# EAGLE design adclk (EAGLE 6.5.0)
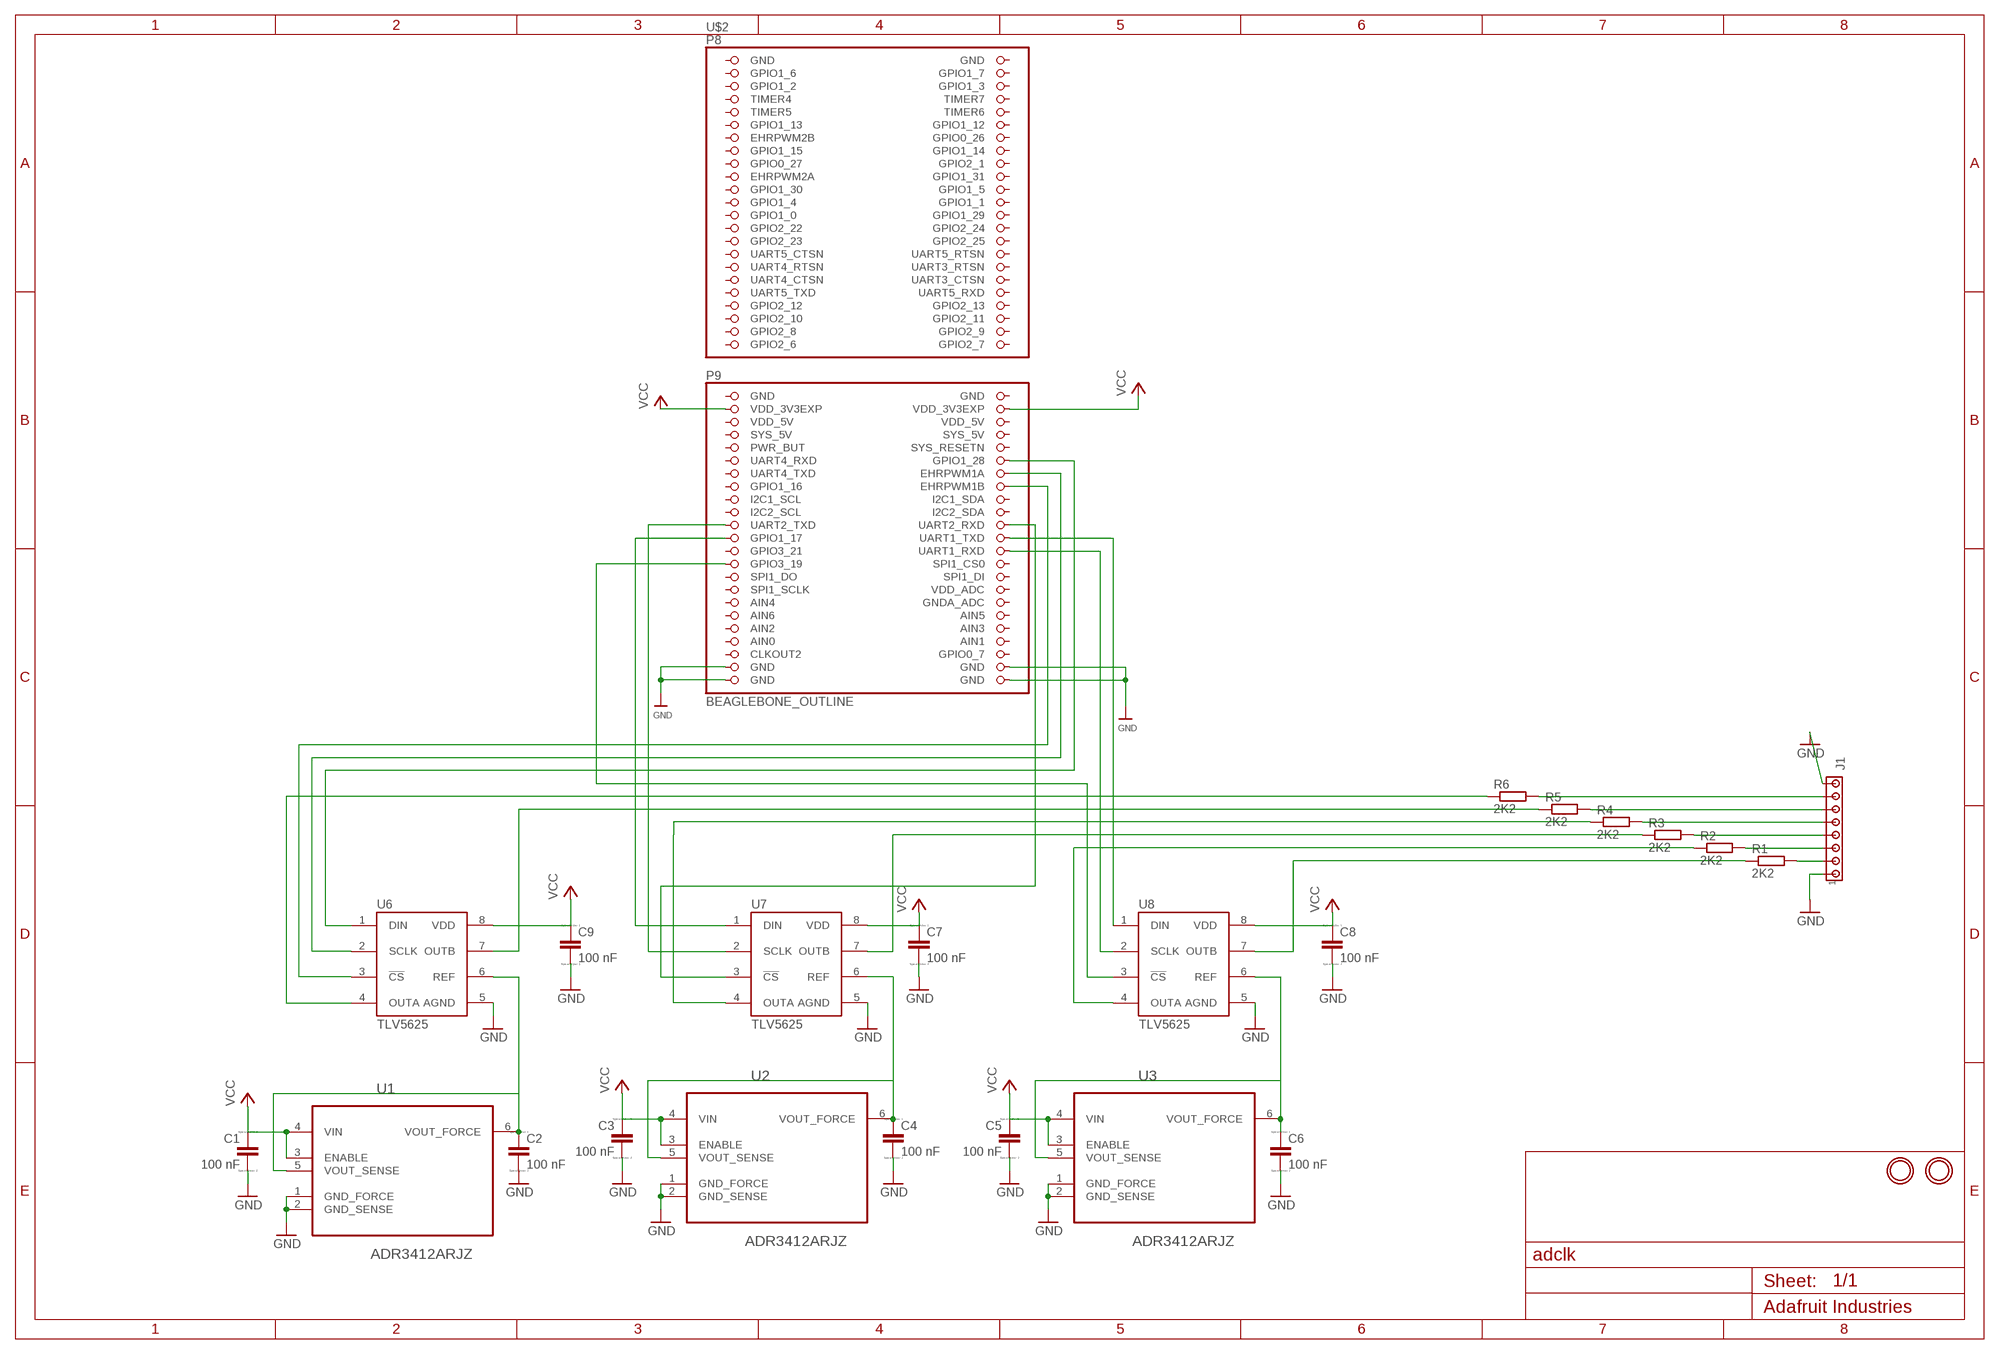
[diagram p0: schematic, sheet 1]

## Parts
C1  100 nF  CC1808  [C1808]
C2  100 nF  CC1808  [C1808]
C3  100 nF  CC1808  [C1808]
C4  100 nF  CC1808  [C1808]
C5  100 nF  CC1808  [C1808]
C6  100 nF  CC1808  [C1808]
C7  100 nF  CC1808  [C1808]
C8  100 nF  CC1808  [C1808]
C9  100 nF  CC1808  [C1808]
J1  MTA08-100  [10X08MTA]
R1  2K2  R-EU_R0805  [R0805]
R2  2K2  R-EU_R0805  [R0805]
R3  2K2  R-EU_R0805  [R0805]
R4  2K2  R-EU_R0805  [R0805]
R5  2K2  R-EU_R0805  [R0805]
R6  2K2  R-EU_R0805  [R0805]
U1  ADR3412ARJZ  [SOT95P280X145-6N]
U2  ADR3412ARJZ  [SOT95P280X145-6N]
U3  ADR3412ARJZ  [SOT95P280X145-6N]
U6  TLV5625  [SO8]
U7  TLV5625  [SO8]
U8  TLV5625  [SO8]
U$2  BEAGLEBONE_OUTLINE  [BEAGLEBONE_SHIELD]
U$22  MOUNTINGHOLE3.0THIN  [MOUNTINGHOLE_3.0_PLATEDTHIN]
U$23  MOUNTINGHOLE3.0THIN  [MOUNTINGHOLE_3.0_PLATEDTHIN]

## Nets
GND: C1.2 C2.2 C3.2 C4.2 C5.2 C6.2 C7.2 C8.2 C9.2 J1.1 J1.8 U1.1(GND_FORCE) U1.2(GND_SENSE) U2.1(GND_FORCE) U2.2(GND_SENSE) U3.1(GND_FORCE) U3.2(GND_SENSE) U6.5(AGND) U7.5(AGND) U8.5(AGND) U$2.89(GND) U$2.90(GND) U$2.91(GND) U$2.92(GND)
N$1: J1.7 R6.2
N$2: J1.6 R5.2
N$3: J1.5 R4.2
N$4: J1.4 R3.2
N$5: J1.3 R2.2
N$6: J1.2 R1.2
N$13: C2.1 U1.5(VOUT_SENSE) U1.6(VOUT_FORCE) U6.6(REF)
N$14: R1.1 U8.7(OUTB)
N$15: C4.1 U2.5(VOUT_SENSE) U2.6(VOUT_FORCE) U7.6(REF)
N$16: R2.1 U8.4(OUTA)
N$17: C6.1 U3.5(VOUT_SENSE) U3.6(VOUT_FORCE) U8.6(REF)
N$18: R3.1 U7.7(OUTB)
N$19: R4.1 U7.4(OUTA)
N$20: R5.1 U6.7(OUTB)
N$21: R6.1 U6.4(OUTA)
N$22: U6.1(DIN) U$2.58(GPIO1_28)
N$23: U6.2(SCLK) U$2.60(EHRPWM1A)
N$24: U6.3(!CS!) U$2.62(EHRPWM1B)
N$25: U8.1(DIN) U$2.70(UART1_TXD)
N$26: U8.2(SCLK) U$2.72(UART1_RXD)
N$27: U8.3(!CS!) U$2.73(GPIO3_19)
N$28: U7.1(DIN) U$2.69(GPIO1_17)
N$29: U7.3(!CS!) U$2.68(UART2_RXD)
N$30: U7.2(SCLK) U$2.67(UART2_TXD)
VCC: C1.1 C3.1 C5.1 C7.1 C8.1 C9.1 U1.3(ENABLE) U1.4(VIN) U2.3(ENABLE) U2.4(VIN) U3.3(ENABLE) U3.4(VIN) U6.8(VDD) U7.8(VDD) U8.8(VDD) U$2.49(VDD_3V3EXP) U$2.50(VDD_3V3EXP)
Unconnected: U$2.5(GPIO1_2) U$2.6(GPIO1_3) U$2.7(TIMER4) U$2.8(TIMER7) U$2.9(TIMER5) U$2.10(TIMER6) U$2.11(GPIO1_13) U$2.12(GPIO1_12) U$2.13(EHRPWM2B) U$2.14(GPIO0_26) U$2.15(GPIO1_15) U$2.16(GPIO1_14) U$2.17(GPIO0_27) U$2.18(GPIO2_1) U$2.19(EHRPWM2A) U$2.20(GPIO1_31) U$2.21(GPIO1_30) U$2.22(GPIO1_5) U$2.23(GPIO1_4) U$2.24(GPIO1_1) U$2.25(GPIO1_0) U$2.26(GPIO1_29) U$2.27(GPIO2_22) U$2.28(GPIO2_24) U$2.29(GPIO2_23) U$2.30(GPIO2_25) U$2.31(UART5_CTSN) U$2.32(UART5_RTSN) U$2.33(UART4_RTSN) U$2.34(UART3_RTSN) U$2.35(UART4_CTSN) U$2.36(UART3_CTSN) U$2.37(UART5_TXD) U$2.38(UART5_RXD) U$2.39(GPIO2_12) U$2.40(GPIO2_13) U$2.41(GPIO2_10) U$2.53(SYS_5V) U$2.54(SYS_5V) U$2.55(PWR_BUT) U$2.56(SYS_RESETN) U$2.57(UART4_RXD) U$2.59(UART4_TXD) U$2.61(GPIO1_16) U$2.63(I2C1_SCL) U$2.64(I2C1_SDA) U$2.65(I2C2_SCL) U$2.66(I2C2_SDA) U$2.71(GPIO3_21) U$2.74(SPI1_CS0) U$2.75(SPI1_DO) U$2.76(SPI1_DI) U$2.77(SPI1_SCLK) U$2.78(VDD_ADC) U$2.79(AIN4) U$2.80(GNDA_ADC) U$2.81(AIN6) U$2.82(AIN5) U$2.83(AIN2) U$2.86(AIN1) U$2.87(CLKOUT2) U$2.88(GPIO0_7)

## Power pins joined to a net without a drawn wire
AIN0: U$2.85(AIN0)
AIN3: U$2.84(AIN3)
GND: U$2.1(GND) U$2.2(GND) U$2.47(GND) U$2.48(GND)
GPIO1_6: U$2.3(GPIO1_6)
GPIO1_7: U$2.4(GPIO1_7)
GPIO2_6: U$2.45(GPIO2_6)
GPIO2_7: U$2.46(GPIO2_7)
GPIO2_8: U$2.43(GPIO2_8)
GPIO2_9: U$2.44(GPIO2_9)
GPIO2_11: U$2.42(GPIO2_11)
VDD_5V: U$2.51(VDD_5V) U$2.52(VDD_5V)

## Library data of the parts
C1-C9 = eagle-ltspice:C: CAPACITOR, European symbol; SPICEMODEL: NONE; SPICEPREFIX: C
J1 = con-amp:MTA08-100: AMP connector
R1-R6 = resistor:R-EU_: RESISTOR, European symbol
U1-U3 = mjw:ADR3412ARJZ: Micropower, High Accuracy Voltage References; MPN: ADR3412ARJZ; OC_FARNELL: 1843661; OC_NEWARK: 12T1265; PACKAGE: SOT-23-6; SUPPLIER: Analog Devices
U6-U8 = mjw:TLV5625: Dual 8-bit DAC
U$2 = microbuilder:BEAGLEBONE_OUTLINE
U$22 U$23 = microbuilder:MOUNTINGHOLE: Mounting Hole

## Board
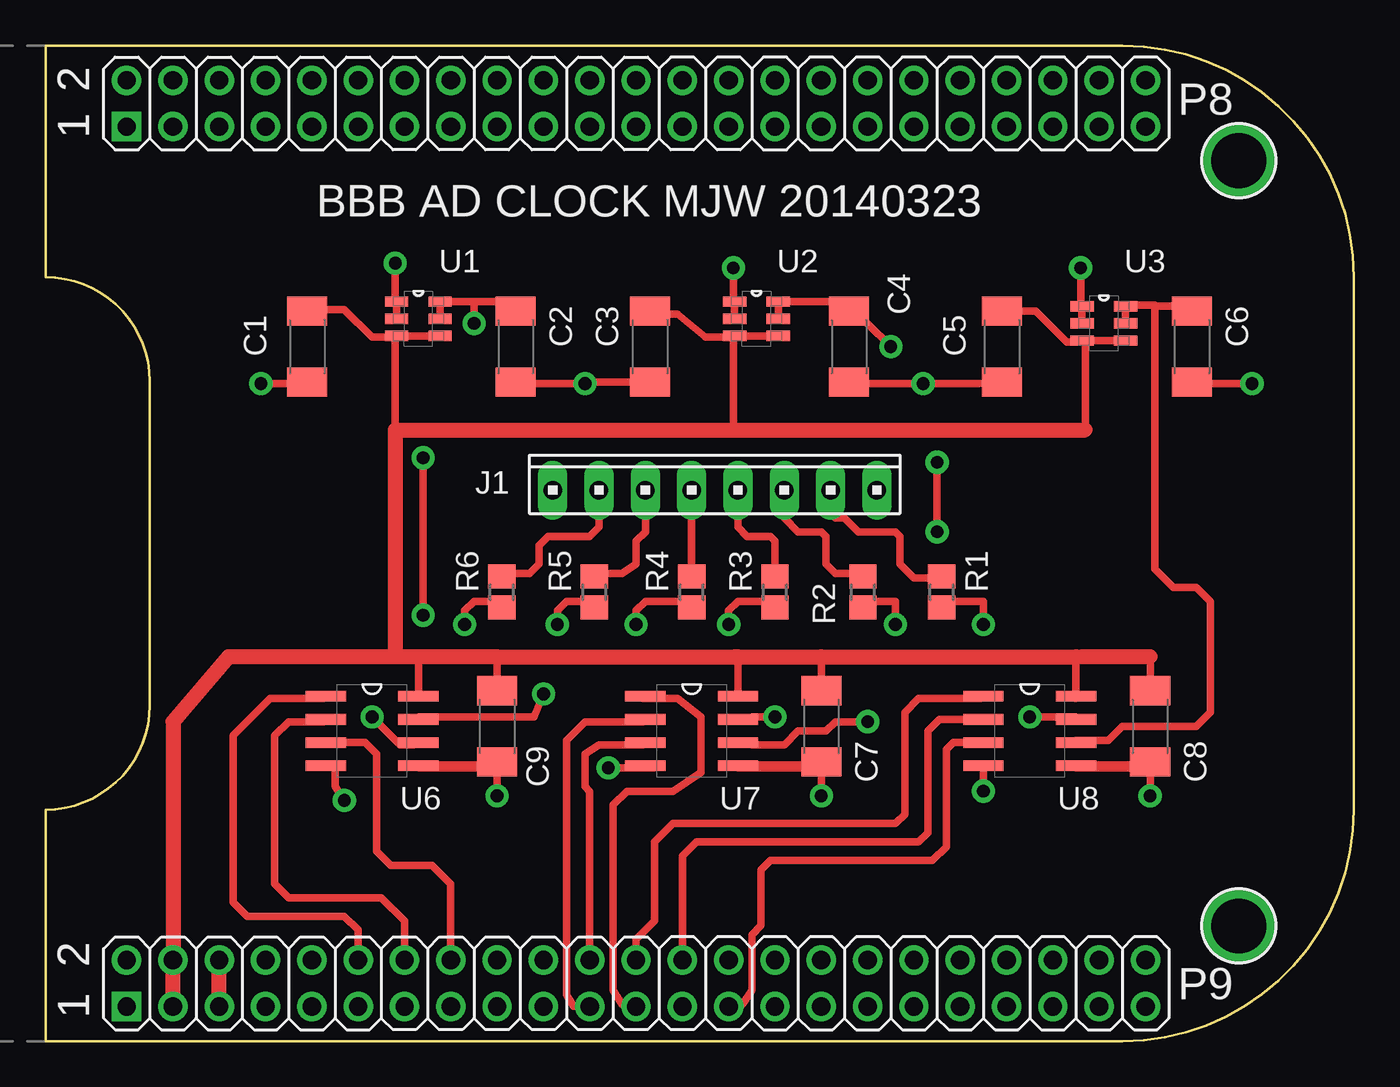
[diagram p1: board, top side]
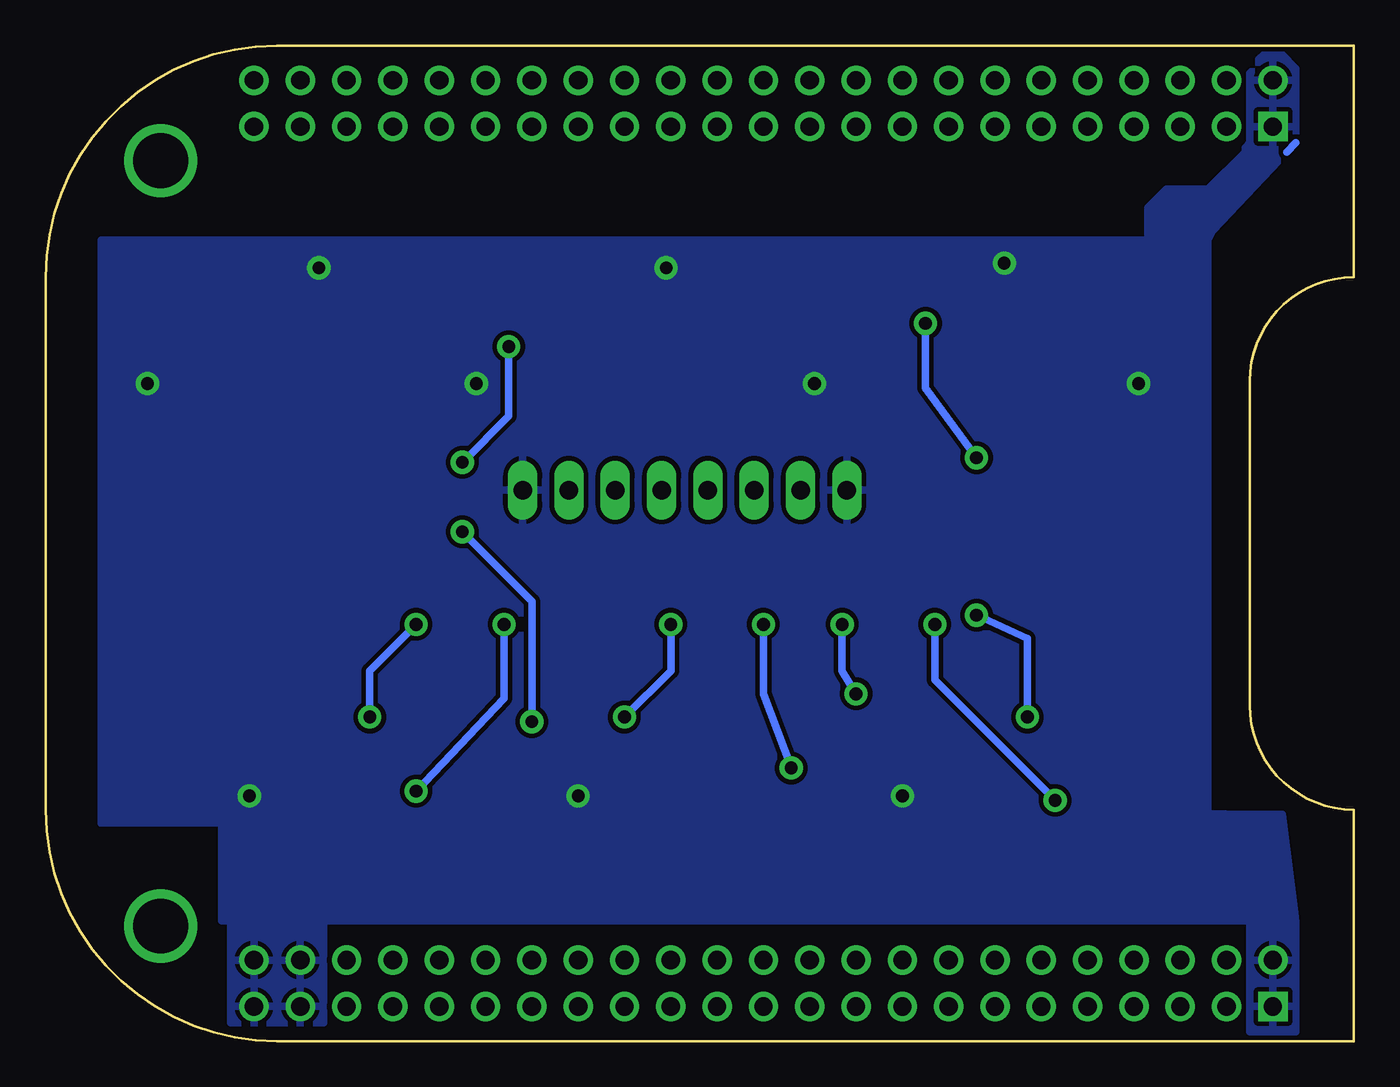
[diagram p2: board, bottom side, seen from below]

Size 71.75 x 54.61 mm. Coordinates in mm from the lower left corner, seen from the top.
Copper layers (1*16): Top 0.035mm / dielectric 1.5mm / Bottom 0.035mm
Design rules "SparkFun10mil": minimum track width 10mil, minimum drill 20mil, track to track 10mil, track to pad 10mil, pad to pad 10mil, via to via 10mil, smd to smd 10mil, copper to edge 10mil, drill to drill 10mil, minimum pad ring 12mil, minimum via ring 10mil, stop-mask expansion 4mil, vias tented up to drill 25mil, thermal gap 10mil

### Footprints (pad centres in the part's own frame; a part is rotated, then mirrored left to right if it is on the bottom)
C1808 = smd 1.6 x 2.2: 1 -1.95,0; 2 1.95,0
10X08MTA = drill 1.016 long: 1 8.89,0; 2 6.35,0; 3 3.81,0; 4 1.27,0; 5 -1.27,0; 6 -3.81,0; 7 -6.35,0; 8 -8.89,0
R0805 = smd 1.3 x 1.5: 1 -0.85,0; 2 0.85,0
SOT95P280X145-6N = smd 1.27 x 0.559: 1 -1.194,0.94; 2 -1.194,0; 3 -1.194,-0.94; 4 1.194,-0.94; 5 1.194,0; 6 1.194,0.94
SO8 = smd 2.21 x 0.584: 1 -2.54,1.905; 2 -2.54,0.635; 3 -2.54,-0.635; 4 -2.54,-1.905; 5 2.54,-1.905; 6 2.54,-0.635; 7 2.54,0.635; 8 2.54,1.905
BEAGLEBONE_SHIELD = drill 1 square: 1 4.445,19.05; 47 52.705,19.05 | drill 1: 2 1.905,19.05; 3 4.445,21.59; 4 1.905,21.59; 5 4.445,24.13; 6 1.905,24.13; 7 4.445,26.67; 8 1.905,26.67; 9 4.445,29.21; 10 1.905,29.21; 11 4.445,31.75; 12 1.905,31.75; 13 4.445,34.29; 14 1.905,34.29; 15 4.445,36.83; 16 1.905,36.83; 17 4.445,39.37; 18 1.905,39.37; 19 4.445,41.91; 20 1.905,41.91; 21 4.445,44.45; 22 1.905,44.45; 23 4.445,46.99; 24 1.905,46.99; 25 4.445,49.53; 26 1.905,49.53; 27 4.445,52.07; 28 1.905,52.07; 29 4.445,54.61; 30 1.905,54.61; 31 4.445,57.15; 32 1.905,57.15; 33 4.445,59.69; 34 1.905,59.69; 35 4.445,62.23; 36 1.905,62.23; 37 4.445,64.77; 38 1.905,64.77; 39 4.445,67.31; 40 1.905,67.31; 41 4.445,69.85; 42 1.905,69.85; 43 4.445,72.39; 44 1.905,72.39; 45 4.445,74.93; 46 1.905,74.93; 48 50.165,19.05; 49 52.705,21.59; 50 50.165,21.59; 51 52.705,24.13; 52 50.165,24.13; 53 52.705,26.67; 54 50.165,26.67; 55 52.705,29.21; 56 50.165,29.21; 57 52.705,31.75; 58 50.165,31.75; 59 52.705,34.29; 60 50.165,34.29; 61 52.705,36.83; 62 50.165,36.83; 63 52.705,39.37; 64 50.165,39.37; 65 52.705,41.91; 66 50.165,41.91; 67 52.705,44.45; 68 50.165,44.45; 69 52.705,46.99; 70 50.165,46.99; 71 52.705,49.53; 72 50.165,49.53; 73 52.705,52.07; 74 50.165,52.07; 75 52.705,54.61; 76 50.165,54.61; 77 52.705,57.15; 78 50.165,57.15; 79 52.705,59.69; 80 50.165,59.69; 81 52.705,62.23; 82 50.165,62.23; 83 52.705,64.77; 84 50.165,64.77; 85 52.705,67.31; 86 50.165,67.31; 87 52.705,69.85; 88 50.165,69.85; 89 52.705,72.39; 90 50.165,72.39; 91 52.705,74.93; 92 50.165,74.93
MOUNTINGHOLE_3.0_PLATEDTHIN = drill 3 pad 3.6: P$1 0,0

### Placement (x,y rotation side)
C1  14.35,38.1 270 top
C2  25.78,38.1 270 top
C3  33.15,38.1 270 top
C4  44.07,38.1 270 top
C5  52.45,38.1 270 top
C6  62.86,38.1 270 top
C7  42.55,17.27 270 top
C8  60.58,17.27 270 top
C9  24.76,17.27 270 top
J1  36.7,30.23 0 top
R1  49.15,24.64 90 top
R2  44.83,24.64 90 top
R3  40,24.64 90 top
R4  35.43,24.64 90 top
R5  30.1,24.64 90 top
R6  25.02,24.64 90 top
U1  20.45,39.62 0 top
U2  38.99,39.62 0 top
U3  58.04,39.37 0 top
U6  17.91,17.02 0 top
U7  35.43,17.02 0 top
U8  53.97,17.02 0 top
U$2  -14.61,54.61 270 top
U$22  65.44,48.3 0 top
U$23  65.44,6.32 0 top

### Tracks (layer width: path | path; a pad name or v marks a point on that pad's centre or on a via)
GND  (via drill 0.7 pad 1.27)
  Top 0.254: 62.36,35.56 C6.2 | 38.23,39.62 U2.2 | C7.2 42.55,15.24 38.73,15.24 U7.5 | 24.76,15.24 20.96,15.24 U6.5 | U8.5 56.52,15.24 60.33,15.24 C8.2
  Top 0.406: U1.2 U1.1 19.18,40.64 v19.18,42.67 | U2.2 U2.1 37.72,40.39 v37.72,42.42 | U3.2 U3.1 56.77,40.39 v56.77,42.42 | 38.1,14.99 U7.5 | 56.64,14.99 U8.5 | v11.81,36.07 14.27,36.07 C1.2 | C2.2 25.86,36.07 v29.59,36.07 29.93,36.15 C3.2 | C4.2 44.15,36.07 v48.13,36.07 51.18,36.07 52.28,36.15 C5.2 | v66.17,36.07 62.95,36.07 C6.2 | v24.76,13.46 24.76,15.24 | 24.76,15.24 C9.2 | v60.58,13.46 60.58,15.24 | 60.58,15.24 C8.2 | v42.55,13.46 42.55,15.24 42.29,14.99 37.97,14.99 | 20.45,14.99 24.51,14.99 24.76,15.24 | 56.52,14.99 60.33,14.99 60.58,15.24
  pour Bottom: 8,43.94 68.71,43.94 68.71,11.94 8,12.19
  pour Bottom: 3.94,12.45 62.1,12.95 62.1,6.6 3.18,6.6
  pour Bottom: 56.52,6.6 56.52,1.02 61.59,1.02 61.59,6.6
  pour Bottom: 3.18,6.6 3.18,0.51 5.71,0.51 5.71,6.6
  pour Bottom: 3.18,53.34 3.94,54.1 4.95,54.1 5.21,53.85 5.21,53.59 5.71,53.09 5.71,49.28 5.97,49.02 5.97,48.77 8,46.74 10.29,46.74 11.3,45.72 11.3,38.86 8.25,38.86 8,38.61 8,43.94 7.75,44.45 3.18,49.28
  pour Bottom: 3.94,12.19 62.1,12.95 62.1,6.6 3.18,6.6
N$1
  Top 0.406: J1.7 30.35,28.19 29.85,27.69 27.56,27.69 27.05,27.18 27.05,26.16 26.54,25.65 25.11,25.65 R6.2
N$2
  Top 0.406: J1.6 32.89,27.94 32.39,27.43 32.39,26.16 31.62,25.65 30.19,25.65 R5.2
N$3
  Top 0.406: J1.5 R4.2
N$4
  Top 0.406: J1.4 37.97,28.19 38.48,27.69 39.75,27.69 40,27.43 R3.2
N$5
  Top 0.406: J1.3 40.51,28.7 41.28,27.94 42.55,27.94 42.8,27.69 42.8,26.16 43.31,25.65 44.67,25.65 R2.2
N$6
  Top 0.406: J1.2 43.05,28.96 43.31,28.7 43.81,28.7 44.58,27.94 46.61,27.94 46.86,27.69 46.86,26.16 47.62,25.4 49.06,25.4 R1.2
N$8
  Bottom 0.406: 3.18,49.28 3.68,48.77
N$13  (via drill 0.7 pad 1.27)
  Top 0.254: 20.19,16.26 U6.6 | 23.5,40.64 23.5,40.56
  Top 0.406: U1.5 U1.6 23.5,40.56 | 23.5,40.56 25.27,40.56 C2.1 | 20.19,16.26 19.43,16.26 v17.91,17.78 | v20.7,32 v20.7,23.37 | 23.5,40.56 v23.5,39.37
  Bottom 0.406: v17.91,17.78 17.91,22.1 v20.7,23.37 | v20.7,32 23.5,35.81 v23.5,39.37
N$14  (via drill 0.7 pad 1.27)
  Top 0.254: 48.89,24.13 R1.1
  Top 0.406: 48.89,24.13 51.44,24.13 v51.44,22.86 | v53.97,17.78 56.52,17.78 U8.7
  Bottom 0.406: v51.44,22.86 53.97,20.32 v53.97,17.78
N$15  (via drill 0.7 pad 1.27)
  Top 0.254: 38.73,16.26 U7.6 | 45.08,39.37 C4.1
  Top 0.406: U2.5 U2.6 44.06,40.56 C4.1 | v45.08,17.53 43.31,17.53 42.8,17.02 41.28,17.02 40.51,16.26 38.73,16.26 | v48.89,31.75 v48.89,27.94 | 45.08,39.37 v46.36,38.1
  Bottom 0.406: v45.08,17.53 45.08,24.13 v48.89,27.94 | v48.89,31.75 46.36,34.29 v46.36,38.1
N$16  (via drill 0.7 pad 1.27)
  Top 0.254: 45.08,24.13 R2.1 | 51.44,15.24 U8.4
  Top 0.406: 45.08,24.13 46.61,24.13 v46.61,22.86 | U8.4 v51.44,13.72
  Bottom 0.406: v46.61,22.86 46.61,18.8 v51.44,13.72
N$17
  Top 0.254: 56.52,16.51 U8.6
  Top 0.406: U3.5 U3.6 59.31,40.39 60.83,40.39 | C6.1 62.6,40.31 60.91,40.31 60.83,40.39 | 60.83,40.39 60.83,25.91 61.85,24.89 63.12,24.89 63.88,24.13 63.88,18.03 63.12,17.27 59.05,17.27 58.29,16.51 56.52,16.51
N$18  (via drill 0.7 pad 1.27)
  Top 0.254: 40,24.13 R3.1 | 38.73,17.78 U7.7
  Top 0.406: 40,24.13 37.97,24.13 37.47,23.62 v37.47,22.86 | 38.73,17.78 v40,17.78
  Bottom 0.406: v37.47,22.86 37.47,20.32 v40,17.78
N$19  (via drill 0.7 pad 1.27)
  Top 0.254: 34.92,24.13 R4.1 | 33.4,14.99 U7.4
  Top 0.406: 34.92,24.13 32.89,24.13 32.39,23.62 v32.39,22.86 | 33.4,14.99 v30.86,14.99
  Bottom 0.406: v32.39,22.86 32.39,19.05 v30.86,14.99
N$20  (via drill 0.7 pad 1.27)
  Top 0.254: 29.85,24.13 R5.1 | 20.45,17.78 U6.7
  Top 0.406: v28.07,22.86 28.07,23.62 28.57,24.13 29.85,24.13 | v27.3,19.05 26.8,17.78 20.45,17.78
  Bottom 0.406: v28.07,22.86 28.07,20.32 v27.3,19.05
N$21  (via drill 0.7 pad 1.27)
  Top 0.254: 24.76,24.13 R6.1 | 15.88,14.99 U6.4
  Top 0.406: 24.76,24.13 23.5,24.13 22.99,23.62 v22.99,22.86 | v16.38,13.21 15.88,13.97 15.88,14.99
  Bottom 0.406: v22.99,22.86 22.99,19.81 v16.38,13.21
N$22
  Top 0.406: U$2.58 17.14,6.1 16.38,6.86 11.05,6.86 10.29,7.62 10.29,16.76 12.32,18.8 15.24,18.8 U6.1
N$23
  Top 0.406: U$2.60 19.68,6.6 18.42,7.87 13.34,7.87 12.57,8.64 12.57,16.76 13.34,17.53 15.24,17.53 U6.2
N$24
  Top 0.406: U6.3 17.53,16.38 18.16,15.75 18.16,10.41 18.92,9.65 21.21,9.65 22.22,8.64 U$2.62
N$25
  Top 0.406: U$2.70 32.39,5.59 33.4,6.6 33.4,10.92 34.42,11.94 46.61,11.94 47.12,12.45 47.12,18.03 47.88,18.8 51.31,18.8 U8.1
N$26
  Top 0.406: U8.2 49.02,17.65 48.39,17.02 48.39,11.43 47.88,10.92 35.69,10.92 34.92,10.16 U$2.72
N$27
  Top 0.406: U8.3 49.78,16.38 49.4,16 49.4,10.67 48.64,9.91 39.75,9.91 39.24,9.4 39.24,6.35 38.73,5.84 38.73,2.79 38.23,2.03 37.59,2.03 U$2.73
N$28
  Top 0.406: U7.1 32.77,18.8 34.67,18.8 35.94,17.78 35.94,14.73 34.42,13.72 31.88,13.72 31.11,12.95 31.11,2.79 31.62,2.03 32.26,2.03 U$2.69
N$29
  Top 0.406: U$2.68 29.85,13.72 29.59,13.97 29.59,15.75 30.35,16.26 32.77,16.26 U7.3
N$30
  Top 0.406: U$2.67 28.96,1.91 28.57,2.54 28.57,16.51 29.59,17.53 32.77,17.53 U7.2
VCC
  Top 0.254: 52.2,40.64 C5.1 | 14.61,40.64 C1.1 | 38.73,19.05 U7.8 37.97,19.05
  Top 0.406: U6.8 20.45,21.08 | C9.1 24.76,21.08 | 56.52,18.8 U8.8 56.52,21.08 56.84,21.08 | 60.58,18.71 C8.1 60.58,21.08 | U1.4 U1.3 19.18,38.61 | 37.8,21.08 37.97,21.08 37.97,19.05 | U2.4 U2.3 37.72,38.61 | U3.4 U3.3 57.02,38.35 | 14.52,39.88 C1.1 14.43,40.13 16.38,40.13 17.91,38.61 19.18,38.61 | 57.02,33.53 57.02,38.35 | C3.1 33.32,39.88 34.67,39.88 36.19,38.61 37.72,38.61 | C5.1 54.31,40.05 56.01,38.35 57.02,38.35 | 37.72,38.61 37.72,33.53 | 19.18,38.61 19.18,33.53 | 42.55,18.8 C7.1 42.55,21.08
  Top 0.813: U$2.49 U$2.50 6.98,17.53 10.03,21.08 19.18,21.08 | 19.18,21.08 20.45,21.08 24.76,21.08 37.8,21.08 | 37.97,21.08 42.55,21.08 56.52,21.08 | 60.58,21.08 56.84,21.08 | 57.02,33.53 37.72,33.53 19.18,33.53 19.18,21.08
VDD_5V
  Top 0.813: U$2.51 U$2.52

### Text on the board
tPlace: 2 | P8 | 1 | BBB AD CLOCK MJW 20140323 | 2 | P9 | 1